# Altium project Kit SECCIM.PrjPcb
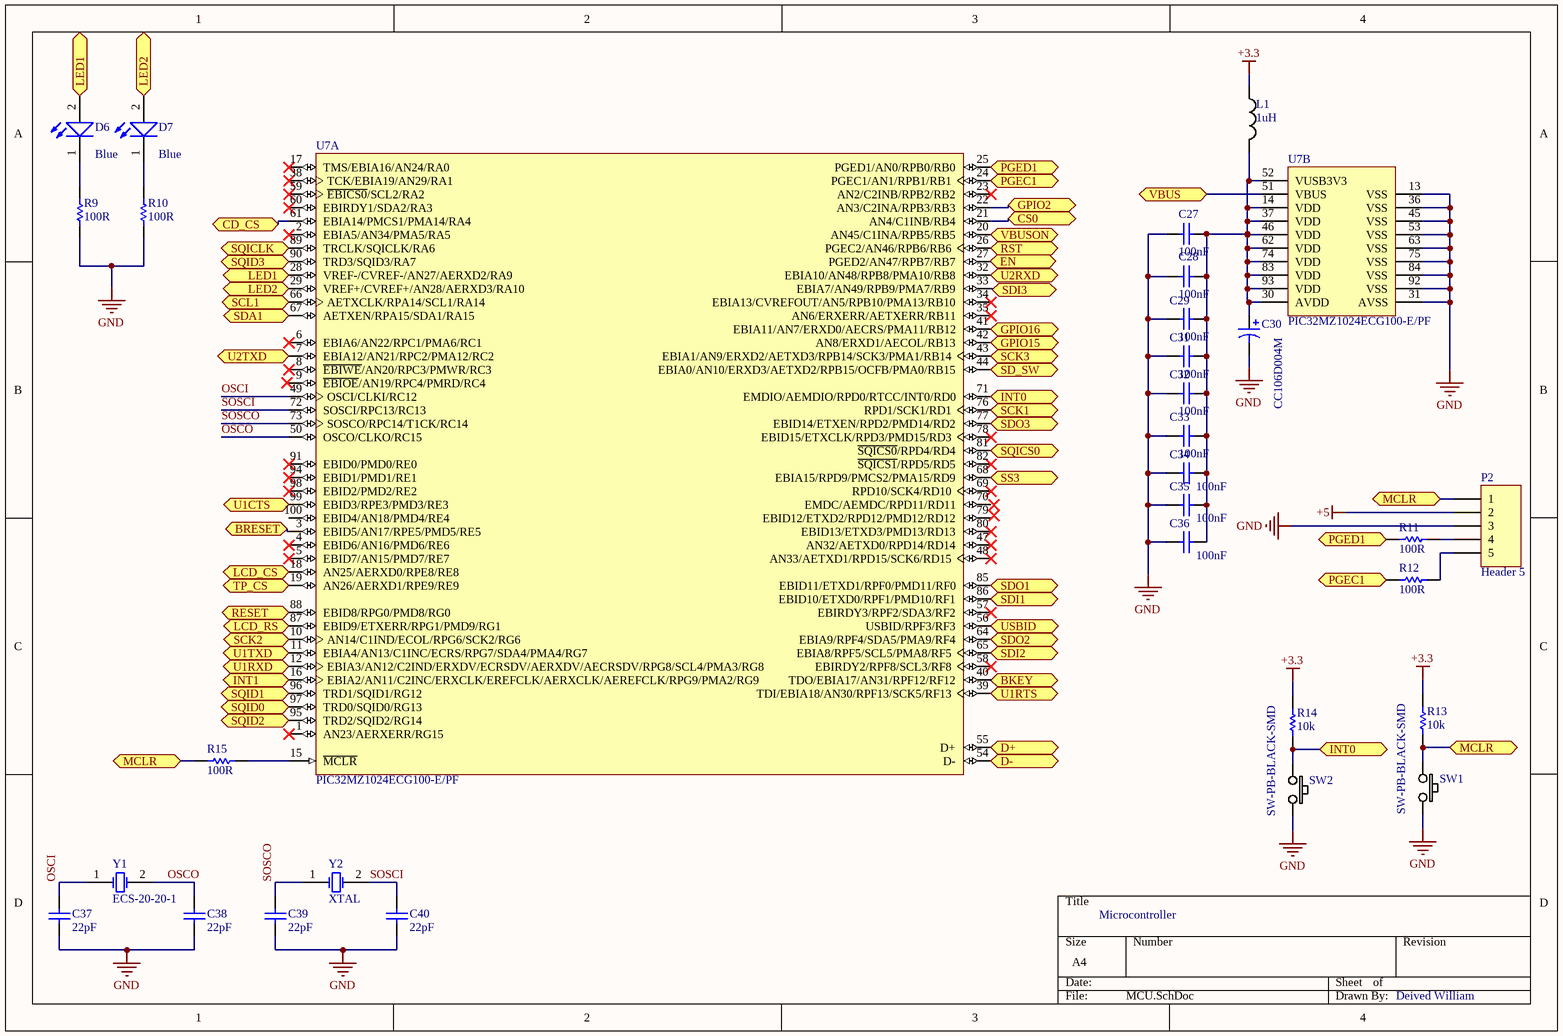
[diagram p0: MCU.SchDoc]
7 sheets, 95 parts. Net scope: flat (ports and power ports of the same name join across sheets).
Board file: PCB.PcbDoc
Sheets:
  MCU.SchDoc
  Memory Nor Flash.SchDoc
  Communication.SchDoc
  LCD.SchDoc
  SD CARD.SchDoc
  CODEC.SchDoc
  Decoupling Capacitors.SchDoc

## Sheet MCU.SchDoc
size A4

### Parts
C27  value 100nF  [WCAP-CSGP_0603, 1.6x0.8x0.8mm_Reflow]  (hidden comment: 885012206020)
C28  value 100nF  [WCAP-CSGP_0603, 1.6x0.8x0.8mm_Reflow]  (hidden comment: 885012206020)
C29  value 100nF  [WCAP-CSGP_0603, 1.6x0.8x0.8mm_Reflow]  (hidden comment: 885012206020)
C30  CC106D004M  [D]
C31  value 100nF  [WCAP-CSGP_0603, 1.6x0.8x0.8mm_Reflow]  (hidden comment: 885012206020)
C32  value 100nF  [WCAP-CSGP_0603, 1.6x0.8x0.8mm_Reflow]  (hidden comment: 885012206020)
C33  value 100nF  [WCAP-CSGP_0603, 1.6x0.8x0.8mm_Reflow]  (hidden comment: 885012206020)
C34  value 100nF  [WCAP-CSGP_0603, 1.6x0.8x0.8mm_Reflow]  (hidden comment: 885012206020)
C35  value 100nF  [WCAP-CSGP_0603, 1.6x0.8x0.8mm_Reflow]  (hidden comment: 885012206020)
C36  value 100nF  [WCAP-CSGP_0603, 1.6x0.8x0.8mm_Reflow]  (hidden comment: 885012206020)
C37  value 22pF  [WCAP-CSGP_0603, 1.6x0.8x0.8mm_Reflow]  (hidden comment: 885012006004)
C38  value 22pF  [WCAP-CSGP_0603, 1.6x0.8x0.8mm_Reflow]  (hidden comment: 885012006004)
C39  value 22pF  [WCAP-CSGP_0603, 1.6x0.8x0.8mm_Reflow]  (hidden comment: 885012006004)
C40  value 22pF  [WCAP-CSGP_0603, 1.6x0.8x0.8mm_Reflow]  (hidden comment: 885012006004)
D6  Emitting Color: Blue  [WL-SMCW_0805]  (hidden comment: 150080BS75000)
D7  Emitting Color: Blue  [WL-SMCW_0805]  (hidden comment: 150080BS75000)
L1  1uH  [TAIYO-NLS5012-GENERIC]
P2  Header 5  [HDR1X5]
R9  100R  [3-0603]
R10  100R  [3-0603]
R11  100R  [3-0603]
R12  100R  [3-0603]
R13  10k  [3-0603]
R14  10k  [3-0603]
R15  100R  [3-0603]
SW1  SW-PB-BLACK-SMD  [SW-PB-SMD]
SW2  SW-PB-BLACK-SMD  [SW-PB-SMD]
U7  PIC32MZ1024ECG100-E/PF  [MCHP-TQFP-PF100_N]  (parts A,B of 2)
Y1  ECS-20-20-1  [HC-49U]
Y2  XTAL  [R38]

### Ports
BKEY, BRESET, CD_CS, CS0, D+, D-, EN, GPIO2, GPIO15, GPIO16, INT0, INT1, LCD_CS, LCD_RS, LED1, LED2, MCLR, PGEC1, PGED1, RESET, RST, SCK1, SCK2, SCK3, SCL1, SD_SW, SDA1, SDI1, SDI2, SDI3, SDO1, SDO2, SDO3, SQICLK, SQICS0, SQID0, SQID1, SQID2, SQID3, SS3, TP_CS, U1CTS, U1RTS, U1RXD, U1TXD, U2RXD, U2TXD, USBID, VBUS, VBUSON

### Nets
+3.3: L1.1 R13.2 R14.2
+5: P2.2
GND: C27.2 C28.2 C29.2 C30.2 C31.2 C32.2 C33.2 C34.2 C35.2 C36.2 C37.1 C38.1 C39.1 C40.1 P2.3 R9.1 R10.1 SW1.2 SW2.2 U7.13(VSS) U7.31(AVSS) U7.36(VSS) U7.45(VSS) U7.53(VSS) U7.63(VSS) U7.75(VSS) U7.84(VSS) U7.92(VSS)
D_N: U7.54(D-) ; port D-
D_P: U7.55(D+) ; port D+
OSCI: C37.2 U7.49(OSCI/CLKI/RC12) Y1.1(OSC1)
OSCO: C38.2 U7.50(OSCO/CLKO/RC15) Y1.2(OSC2)
SOSCI: C40.2 U7.72(SOSCI/RPC13/RC13) Y2.2(OSC2)
SOSCO: C39.2 U7.73(SOSCO/RPC14/T1CK/RC14) Y2.1(OSC1)
NetC18_2: U7.51(VBUS) ; port VBUS
NetC27_1: C27.1 C28.1 C29.1 C30.1 C31.1 C32.1 C33.1 C34.1 C35.1 C36.1 L1.2 U7.14(VDD) U7.30(AVDD) U7.37(VDD) U7.46(VDD) U7.52(VUSB3V3) U7.62(VDD) U7.74(VDD) U7.83(VDD) U7.93(VDD)
NetD6_1: D6.1(K) R9.2
NetD6_2: D6.2(A) U7.28(VREF-/CVREF-/AN27/AERXD2/RA9) ; port LED1
NetD7_1: D7.1(K) R10.2
NetD7_2: D7.2(A) U7.29(VREF+/CVREF+/AN28/AERXD3/RA10) ; port LED2
NetJ2_4: U7.56(USBID/RPF3/RF3) ; port USBID
NetJ4_2: U7.61(EBIA14/PMCS1/PMA14/RA4) ; port CD_CS
NetJ4_3: U7.64(EBIA9/RPF4/SDA5/PMA9/RF4) ; port SDO2
NetJ4_5: U7.10(AN14/C1IND/ECOL/RPG6/SCK2/RG6) ; port SCK2
NetJ4_7: U7.65(EBIA8/RPF5/SCL5/PMA8/RF5) ; port SDI2
NetJ4_11: U7.44(EBIA0/AN10/ERXD3/AETXD2/RPB15/OCFB/PMA0/RB15) ; port SD_SW
NetP1_11: U7.16(EBIA2/AN11/C2INC/ERXCLK/EREFCLK/AERXCLK/AEREFCLK/RPG9/PMA2/RG9) ; port INT1
NetP1_13: U7.88(EBID8/RPG0/PMD8/RG0) ; port RESET
NetP1_15: U7.87(EBID9/ETXERR/RPG1/PMD9/RG1) ; port LCD_RS
NetP1_19: U7.85(EBID11/ETXD1/RPF0/PMD11/RF0) ; port SDO1
NetP1_21: U7.86(EBID10/ETXD0/RPF1/PMD10/RF1) ; port SDI1
NetP1_23: U7.76(RPD1/SCK1/RD1) ; port SCK1
NetP1_24: U7.18(AN25/AERXD0/RPE8/RE8) ; port LCD_CS
NetP1_26: U7.19(AN26/AERXD1/RPE9/RE9) ; port TP_CS
NetP2_1: P2.1 R13.1 R15.1 SW1.1 ; port MCLR
NetP2_4: P2.4 R11.2
NetP2_5: P2.5 R12.2
NetR3_1: U7.66(AETXCLK/RPA14/SCL1/RA14) ; port SCL1
NetR4_1: U7.67(AETXEN/RPA15/SDA1/RA15) ; port SDA1
NetR11_1: R11.1 U7.25(PGED1/AN0/RPB0/RB0) ; port PGED1
NetR12_1: R12.1 U7.24(PGEC1/AN1/RPB1/RB1) ; port PGEC1
NetR14_1: R14.1 SW2.1 U7.71(EMDIO/AEMDIO/RPD0/RTCC/INT0/RD0) ; port INT0
NetR15_2: R15.2 U7.15(~{MCLR})
NetR16_1: U7.89(TRCLK/SQICLK/RA6) ; port SQICLK
NetR17_2: U7.81(~{SQICS0}/RPD4/RD4) ; port SQICS0
NetR18_1: U7.97(TRD0/SQID0/RG13) ; port SQID0
NetR19_2: U7.95(TRD2/SQID2/RG14) ; port SQID2
NetR20_1: U7.96(TRD1/SQID1/RG12) ; port SQID1
NetR21_2: U7.90(TRD3/SQID3/RA7) ; port SQID3
NetU1_5: U7.43(EBIA1/AN9/ERXD2/AETXD3/RPB14/SCK3/PMA1/RB14) ; port SCK3
NetU1_6: U7.77(EBID14/ETXEN/RPD2/PMD14/RD2) ; port SDO3
NetU1_7: U7.68(EBIA15/RPD9/PMCS2/PMA15/RD9) ; port SS3
NetU1_8: U7.33(EBIA7/AN49/RPB9/PMA7/RB9) ; port SDI3
NetU2_1: U7.12(EBIA3/AN12/C2IND/ERXDV/ECRSDV/AERXDV/AECRSDV/RPG8/SCL4/PMA3/RG8) ; port U1RXD
NetU2_2: U7.11(EBIA4/AN13/C1INC/ECRS/RPG7/SDA4/PMA4/RG7) ; port U1TXD
NetU2_3: U7.39(TDI/EBIA18/AN30/RPF13/SCK5/RF13) ; port U1RTS
NetU2_4: U7.99(EBID3/RPE3/PMD3/RE3) ; port U1CTS
NetU2_11: U7.3(EBID5/AN17/RPE5/PMD5/RE5) ; port BRESET
NetU2_34: U7.40(TDO/EBIA17/AN31/RPF12/RF12) ; port BKEY
NetU3_7: U7.20(AN45/C1INA/RPB5/RB5) ; port VBUSON
NetU4_1: U7.26(PGEC2/AN46/RPB6/RB6) ; port RST
NetU4_3: U7.27(PGED2/AN47/RPB7/RB7) ; port EN
NetU4_4: U7.41(EBIA11/AN7/ERXD0/AECRS/PMA11/RB12) ; port GPIO16
NetU4_16: U7.42(AN8/ERXD1/AECOL/RB13) ; port GPIO15
NetU4_17: U7.22(AN3/C2INA/RPB3/RB3) ; port GPIO2
NetU4_18: U7.21(AN4/C1INB/RB4) ; port CS0
NetU4_21: U7.7(EBIA12/AN21/RPC2/PMA12/RC2) ; port U2TXD
NetU4_22: U7.32(EBIA10/AN48/RPB8/PMA10/RB8) ; port U2RXD

Not connected (* = marked no-connect by the designer): U7 1(AN23/AERXERR/RG15)* 2(EBIA5/AN34/PMA5/RA5)* 4(EBID6/AN16/PMD6/RE6)* 5(EBID7/AN15/PMD7/RE7)* 6(EBIA6/AN22/RPC1/PMA6/RC1)* 8(~{EBIWE}/AN20/RPC3/PMWR/RC3)* 9(~{EBIOE}/AN19/RPC4/PMRD/RC4) 17(TMS/EBIA16/AN24/RA0)* 23(AN2/C2INB/RPB2/RB2)* 34(EBIA13/CVREFOUT/AN5/RPB10/PMA13/RB10)* 35(AN6/ERXERR/AETXERR/RB11)* 38(TCK/EBIA19/AN29/RA1)* 47(AN32/AETXD0/RPD14/RD14)* 48(AN33/AETXD1/RPD15/SCK6/RD15)* 57(EBIRDY3/RPF2/SDA3/RF2)* 58(EBIRDY2/RPF8/SCL3/RF8)* 59(~{EBICS0}/SCL2/RA2)* 60(EBIRDY1/SDA2/RA3)* 69(RPD10/SCK4/RD10)* 70(EMDC/AEMDC/RPD11/RD11) 78(EBID15/ETXCLK/RPD3/PMD15/RD3)* 79(EBID12/ETXD2/RPD12/PMD12/RD12) 80(EBID13/ETXD3/PMD13/RD13)* 82(~{SQICS1}/RPD5/RD5)* 91(EBID0/PMD0/RE0)* 94(EBID1/PMD1/RE1)* 98(EBID2/PMD2/RE2)* 100(EBID4/AN18/PMD4/RE4)

### Notes on the sheet
- Microcontroller
- Deived William

### Library data of the parts
C27-C29 C31-C36 = 885012206020: WCAP-CSGP Ceramic Capacitors, size 0603, 1.6x0.8x0.8mm, 10V, X7R, 100nF; Rated Voltage: 10V DC; ComponentLink1Description: Manufacturer; ComponentLink1URL: http://www.we-online.de; ComponentLink2Description: Datasheet; ComponentLink2URL: http://katalog.we-online.de/pbs/datasheet/885012206020.pdf; Part Number: 885012206020; Published Date: June 2017; Publisher: Wurth Elektronik; Size: 0603, 1.6x0.8x0.8mm; Ceramic Type: X7R
C30 = CC106D004M: Conformal Coated Solid Tantalum Chip Capacitor: Standard Range, 10uF, 20% Tolerance, 4 WVDC @ -55°C to +85°C, Surge = 5V; Note: See Data Sheet for full range of components; Published: 19-Mar-2004; DatasheetDocument: 21-Mar-2002; PackageReference: D; Publisher: Altium Limited; ComponentLink1Description: Manufacturer Link; ComponentLink1URL: http://www.vishay.com/; ComponentLink2Description: Datasheet; ComponentLink2URL: http://www.vishay.com/docs/43017/ccec.pdf; Value: 10uF
C37-C40 = 885012006004: WCAP-CSGP Ceramic Capacitors, size 0603, 1.6x0.8x0.8mm, 10V, NP0, 22pF; Rated Voltage: 10V DC; ComponentLink1Description: Manufacturer; ComponentLink1URL: http://www.we-online.de; ComponentLink2Description: Datasheet; ComponentLink2URL: http://katalog.we-online.de/pbs/datasheet/885012006004.pdf; Part Number: 885012006004; Published Date: June 2017; Publisher: Wurth Elektronik; Size: 0603, 1.6x0.8x0.8mm; Ceramic Type: NP0
D6 D7 = 150080BS75000: WL-SMCW SMD Mono-color Chip LED Waterclear, size 0805, Blue; Forward Voltage: 3.2 V; Viewing Angle: 140°; Peak Wavelength: 465 nm; Published Date: Jan 2017; Publisher: Wurth Elektronik; ComponentLink1Description: Manufacturer; ComponentLink1URL: http://www.we-online.de; ComponentLink2Description: Datasheet; ComponentLink2URL: http://katalog.we-online.de/led/datasheet/150080BS75000.pdf; Part Number: 150080BS75000; Size: 0805
L1 = 1U-NRS5012-TAIYO: 1U-NRS5012
P2 = Header 5: Header, 5-Pin; LatestRevisionDate: 17-Jul-2002; LatestRevisionNote: Re-released for DXP Platform.; Publisher: Altium Limited
R9-R15 = ERJ3RE: Precision Thick Film Chip Resistor, 10 Ohm to 1M Ohm Range, 1% and 0.5% Tolerance, 0603 Size, 0.063 W; Published: 17-Dec-2003; LatestRevisionDate: 19-Mar-2004; LatestRevisionNote: Silkscreen size reduced.; PackageDocument: Mar-2003; PackageReference: 3-0603; Publisher: Altium Limited; Code_IPC: 1608 [0603]; ComponentLink1Description: Manufacturer Link; ComponentLink1URL: http://www.panasonic.com/industrial/components/resistive_products.htm; ComponentLink2Description: Datasheet; ComponentLink2URL: http://www.panasonic.com/industrial/components/pdf/AOA0000CE2.pdf
SW1 SW2 = SW-PB-BLACK-SMD: PUSHBUTTON SWITCH 6MM SMD
U7 = PIC32MZ1024ECG100-E/PF: 32-Bit Microcontroller with Audio and Graphics Interfaces, HS USB, Ethernet, and Advanced Analog, 1024 KB Program Memory, 78 I/O Pins, PMP, Extended Temperature, 100-Pin TQFP (PF100), Tray; Manufacturer: Microchip; VCC Range: 2.2 to 3.6 V; DatasheetVersion: Rev. B; PackageVersion: C04-110B, 12/2012; PackageReference: TQFP-PF100; PackageDescription: 100-Lead Thin Plastic Quad Flat Pack, 14 x 14 mm Body, 0.5 mm Pitch; Supplier 1: Newark; Supplier Part Number 1: 17X9269; Supplier 2: Mouser; Supplier Part Number 2: 579-1024ECG100-E/PF; Packing: Tray; Mounting Technology: Surface Mount; PartNumber: PIC32MZ1024ECG100-E/PF; ComponentLink1Description: Manufacturer URL; ComponentLink1URL: http://www.microchip.com/; ComponentLink2Description: Datasheet; ComponentLink2URL: http://ww1.microchip.com/downloads/en/DeviceDoc/60001191B.pdf; ComponentLink3Description: Package Specification; ComponentLink3URL: http://www.microchip.com/stellent/groups/techpub_sg/documents/packagingspec/en012702.pdf
Y1 = ECS-20-20-1: Crystal Oscillator; Published: 17-Jul-2002; DatasheetDocument: 18-Apr-2000; PackageReference: HC-49U; Publisher: Altium Limited; ComponentLink1Description: Manufacturer Link; ComponentLink1URL: http://www.ecsxtal.com/; ComponentLink2Description: Datasheet; ComponentLink2URL: http://www.ecsxtal.com/pdf2/HC49U.PDF
Y2 = XTAL: Crystal Oscillator; Published: 8-Jun-2000; LatestRevisionDate: 17-Jul-2002; LatestRevisionNote: Re-released for DXP Platform.; PackageReference: R38; Publisher: Altium Limited; PackageDescription: Crystal, Thru-Hole; 2 Leads; Body 3.1 x 8.2 mm (Dia.xH)

## Sheet Memory Nor Flash.SchDoc
size A4
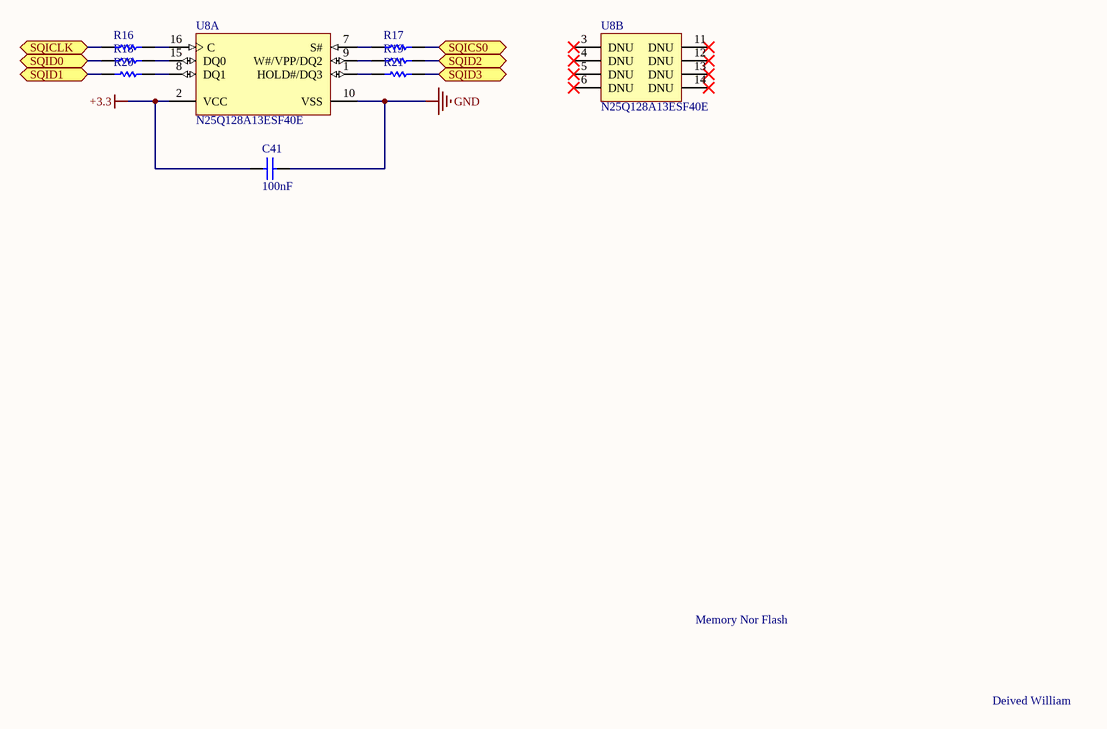
[diagram p1: Memory Nor Flash.SchDoc]

### Parts
C41  value 100nF  [WCAP-CSGP_0603, 1.6x0.8x0.8mm_Reflow]  (hidden comment: 885012206020)
R16  50R  [3-0603]  (value not drawn)
R17  50R  [3-0603]  (value not drawn)
R18  50R  [3-0603]  (value not drawn)
R19  50R  [3-0603]  (value not drawn)
R20  50R  [3-0603]  (value not drawn)
R21  50R  [3-0603]  (value not drawn)
U8  N25Q128A13ESF40E  [MICT-SF-16_N]  (parts A,B of 2)

### Ports
SQICLK, SQICS0, SQID0, SQID1, SQID2, SQID3

### Nets
+3.3: C41.1 U8.2(VCC)
GND: C41.2 U8.10(VSS)
NetR16_1: R16.1 ; port SQICLK
NetR16_2: R16.2 U8.16(C)
NetR17_1: R17.1 U8.7(S#)
NetR17_2: R17.2 ; port SQICS0
NetR18_1: R18.1 ; port SQID0
NetR18_2: R18.2 U8.15(DQ0)
NetR19_1: R19.1 U8.9(W#/VPP/DQ2)
NetR19_2: R19.2 ; port SQID2
NetR20_1: R20.1 ; port SQID1
NetR20_2: R20.2 U8.8(DQ1)
NetR21_1: R21.1 U8.1(HOLD#/DQ3)
NetR21_2: R21.2 ; port SQID3

Not connected (* = marked no-connect by the designer): U8 3(DNU)* 4(DNU)* 5(DNU)* 6(DNU)* 11(DNU)* 12(DNU)* 13(DNU)* 14(DNU)*

### Notes on the sheet
- Memory Nor Flash
- Deived William

### Library data of the parts
C41 = 885012206020: as C27 on sheet MCU; ComponentLink1Description: Manufacturer; ComponentLink1URL: http://www.we-online.de; ComponentLink2Description: Datasheet; ComponentLink2URL: http://katalog.we-online.de/pbs/datasheet/885012206020.pdf; Part Number: 885012206020; Published Date: June 2017; Publisher: Wurth Elektronik; Size: 0603, 1.6x0.8x0.8mm; Ceramic Type: X7R
R16-R21 = ERJ3RE: as R9 on sheet MCU; Published: 17-Dec-2003; LatestRevisionDate: 19-Mar-2004; LatestRevisionNote: Silkscreen size reduced.; PackageDocument: Mar-2003; PackageReference: 3-0603; Publisher: Altium Limited; Code_IPC: 1608 [0603]; ComponentLink1Description: Manufacturer Link; ComponentLink1URL: http://www.panasonic.com/industrial/components/resistive_products.htm; ComponentLink2Description: Datasheet; ComponentLink2URL: http://www.panasonic.com/industrial/components/pdf/AOA0000CE2.pdf
U8 = N25Q128A13ESF40E: 128 Mb (x1/x2/x4) Serial NOR Flash Memory with Multi I/O, 108 MHz, 2.7 to 3.6 V, 16-pin SO16 Wide (SF), Tray; Part Family: N25Q; Manufacturer: Micron; Density: 128Mb; Speed: 108 MHz; Voltage: 2.7V-3.6V; DatasheetVersion: Rev. L; PackageVersion: Rev. F; PackageReference: MICT-SF-16; PackageDescription: 16-Pin SO Wide, 7.5 X 10.3 mm, Pitch 1.27 mm; Applications: Embedded; Package: SO16 Wide; Part Status: Production; RoHS: Yes; Type: Multi I/O; Width: x1/x2/x4; Mounting Technology: Surface Mount; PartNumber: N25Q128A13ESF40E; ComponentLink1Description: Manufacturer URL; ComponentLink1URL: http://www.micron.com/; ComponentLink2Description: Datasheet; ComponentLink2URL: http://www.micron.com/~/media/Documents/Products/Data%20Sheet/NOR%20Flash/Serial%20NOR/N25Q/n25q_128mb_3v_65nm.pdf; ComponentLink3Description: Package Specification; ComponentLink3URL: http://www.micron.com/~/media/Documents/Products/Data%20Sheet/NOR%20Flash/Serial%20NOR/N25Q/n25q_1gb_3v_65nm.pdf

## Sheet Communication.SchDoc
size A4
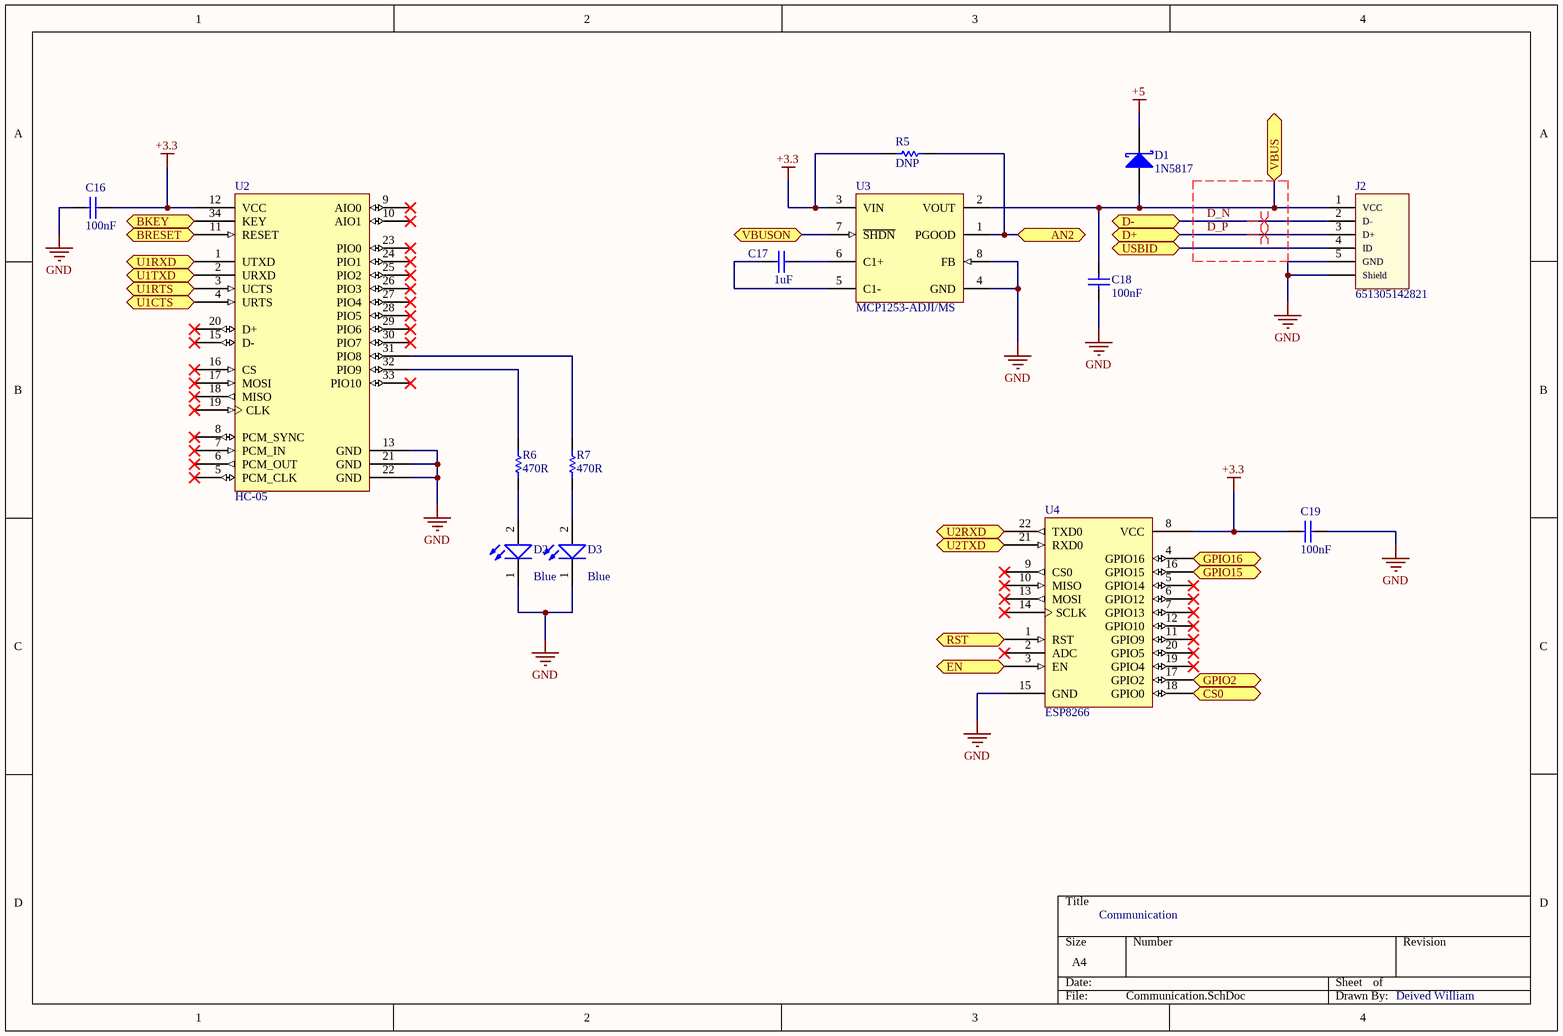
[diagram p2: Communication.SchDoc]

### Parts
C16  value 100nF  [WCAP-CSGP_0603, 1.6x0.8x0.8mm_Reflow]  (hidden comment: 885012206020)
C17  value 1uF  [WCAP-CSGP_0603, 1.6x0.8x0.8mm_Reflow]  (hidden comment: 885012106022)
C18  value 100nF  [WCAP-CSGP_0603, 1.6x0.8x0.8mm_Reflow]  (hidden comment: 885012206020)
C19  value 100nF  [WCAP-CSGP_0603, 1.6x0.8x0.8mm_Reflow]  (hidden comment: 885012206020)
D1  1N5817  [MELFDIODE]
D2  Emitting Color: Blue  [WL-SMCW_0805]  (hidden comment: 150080BS75000)
D3  Emitting Color: Blue  [WL-SMCW_0805]  (hidden comment: 150080BS75000)
J2  651305142821  [651305142821]
R5  DNP  [3-0603]
R6  470R  [3-0603]
R7  470R  [3-0603]
U2  HC-05  [LCC42]
U3  MCP1253-ADJI/MS  [MSOP-MS8_N]
U4  ESP8266  [LCC28]

### Ports
AN2, BKEY, BRESET, CS0, D+, D-, EN, GPIO2, GPIO15, GPIO16, RST, U1CTS, U1RTS, U1RXD, U1TXD, U2RXD, U2TXD, USBID, VBUS, VBUSON

### Nets
+3.3: C16.2 C19.1 R5.1 U2.12(VCC) U3.3(VIN) U4.8(VCC)
+5: D1.2(K)
GND: C16.1 C18.1 C19.2 D2.1(K) D3.1(K) J2.5(GND) J2.Shell(Shield) U2.13(GND) U2.21(GND) U2.22(GND) U3.4(GND) U3.8(FB) U4.15(GND)
D_N: J2.2(D-) ; port D-
D_P: J2.3(D+) ; port D+
NetC17_1: C17.1 U3.6(C1+)
NetC17_2: C17.2 U3.5(C1-)
NetC18_2: C18.2 D1.1(A) J2.1(VCC) U3.2(VOUT) ; port VBUS
NetD2_2: D2.2(A) R6.1
NetD3_2: D3.2(A) R7.1
NetJ2_4: J2.4(ID) ; port USBID
NetR5_2: R5.2 U3.1(PGOOD) ; port AN2
NetR6_2: R6.2 U2.32(PIO9)
NetR7_2: R7.2 U2.31(PIO8)
NetU2_1: U2.1(UTXD) ; port U1RXD
NetU2_2: U2.2(URXD) ; port U1TXD
NetU2_3: U2.3(UCTS) ; port U1RTS
NetU2_4: U2.4(URTS) ; port U1CTS
NetU2_11: U2.11(RESET) ; port BRESET
NetU2_34: U2.34(KEY) ; port BKEY
NetU3_7: U3.7(~{SHDN}) ; port VBUSON
NetU4_1: U4.1(RST) ; port RST
NetU4_3: U4.3(EN) ; port EN
NetU4_4: U4.4(GPIO16) ; port GPIO16
NetU4_16: U4.16(GPIO15) ; port GPIO15
NetU4_17: U4.17(GPIO2) ; port GPIO2
NetU4_18: U4.18(GPIO0) ; port CS0
NetU4_21: U4.21(RXD0) ; port U2TXD
NetU4_22: U4.22(TXD0) ; port U2RXD

Not connected (* = marked no-connect by the designer): U2 5(PCM_CLK)* 6(PCM_OUT)* 7(PCM_IN)* 8(PCM_SYNC)* 9(AIO0)* 10(AIO1)* 15(D-)* 16(CS)* 17(MOSI)* 18(MISO)* 19(CLK)* 20(D+)* 23(PIO0)* 24(PIO1)* 25(PIO2)* 26(PIO3)* 27(PIO4)* 28(PIO5)* 29(PIO6)* 30(PIO7)* 33(PIO10)*; U4 2(ADC)* 5(GPIO14)* 6(GPIO12)* 7(GPIO13)* 9(CS0)* 10(MISO)* 11(GPIO9)* 12(GPIO10)* 13(MOSI)* 14(SCLK)* 19(GPIO4)* 20(GPIO5)*

### Layout directives
differential pair: D_N, D_P

### Notes on the sheet
- Communication
- Deived William

### Library data of the parts
C16 C18 C19 = 885012206020: as C27 on sheet MCU; ComponentLink1Description: Manufacturer; ComponentLink1URL: http://www.we-online.de; ComponentLink2Description: Datasheet; ComponentLink2URL: http://katalog.we-online.de/pbs/datasheet/885012206020.pdf; Part Number: 885012206020; Published Date: June 2017; Publisher: Wurth Elektronik; Size: 0603, 1.6x0.8x0.8mm; Ceramic Type: X7R
C17 = 885012106022: WCAP-CSGP Ceramic Capacitors, size 0603, 1.6x0.8x0.8mm, 25V, X5R, 1uF; Rated Voltage: 25V DC; ComponentLink1Description: Manufacturer; ComponentLink1URL: http://www.we-online.de; ComponentLink2Description: Datasheet; ComponentLink2URL: http://katalog.we-online.de/pbs/datasheet/885012106022.pdf; Part Number: 885012106022; Published Date: June 2017; Publisher: Wurth Elektronik; Size: 0603, 1.6x0.8x0.8mm; Ceramic Type: X5R
D1 = 1N5817: Schottky diode Barrier Rectifier
D2 D3 = 150080BS75000: as D6 on sheet MCU; Published Date: Jan 2017; Publisher: Wurth Elektronik; ComponentLink1Description: Manufacturer; ComponentLink1URL: http://www.we-online.de; ComponentLink2Description: Datasheet; ComponentLink2URL: http://katalog.we-online.de/led/datasheet/150080BS75000.pdf; Part Number: 150080BS75000; Size: 0805
J2 = 651305142821: Mini USB 2.0 Type AB SMT Horizontal 5 Contacts WR-COM; Interface Type: Type AB; Gender: Receptacle; ComponentLink1Description: Manufacturer; ComponentLink1URL: http://www.we-online.de; ComponentLink2Description: Datasheet; ComponentLink2URL: http://katalog.we-online.de/em/datasheet/651305142821.pdf; Part Number: 651305142821; Published Date: April 2017; Publisher: Wurth Elektronik; Sub-Family: Mini USB 2.0; Type: Horizontal; Construction: SMT
R5 = ERJ3RB: Precision Thick Film Chip Resistor, 10 Ohm to 1M Ohm Range, 1% and 0.5% Tolerance, 0603 Size, 0.063 W; Published: 17-Dec-2003; LatestRevisionDate: 19-Mar-2004; LatestRevisionNote: Silkscreen size reduced.; PackageDocument: Mar-2003; PackageReference: 3-0603; Publisher: Altium Limited; Code_IPC: 1608 [0603]; ComponentLink1Description: Manufacturer Link; ComponentLink1URL: http://www.panasonic.com/industrial/components/resistive_products.htm; ComponentLink2Description: Datasheet; ComponentLink2URL: http://www.panasonic.com/industrial/components/pdf/AOA0000CE2.pdf
R6 R7 = ERJ3RE: as R9 on sheet MCU; Published: 17-Dec-2003; LatestRevisionDate: 19-Mar-2004; LatestRevisionNote: Silkscreen size reduced.; PackageDocument: Mar-2003; PackageReference: 3-0603; Publisher: Altium Limited; Code_IPC: 1608 [0603]; ComponentLink1Description: Manufacturer Link; ComponentLink1URL: http://www.panasonic.com/industrial/components/resistive_products.htm; ComponentLink2Description: Datasheet; ComponentLink2URL: http://www.panasonic.com/industrial/components/pdf/AOA0000CE2.pdf
U2 = Bluetooth HC-05: Modulo Bluetooth HC-05
U3 = MCP1253-ADJI/MS: Low Noise, Positive-Regulated Charge Pump, 1MHz, Adjustable Output, 8-Pin MSOP, Industrial Temperature; Published: 29-Jan-2009; DatasheetVersion: revA, Nov-2002; PackageVersion: revBB, Aug-2009; PackageReference: MSOP-MS8; Publisher: Altium Limited; PackageDescription: 8-Lead Plastic Micro Small Outline Package (MS) [MSOP]; Supplier 1: Digi-Key; Supplier Part Number 1: MCP1253-ADJI/MS-ND; Supplier 2: Farnell; Supplier Part Number 2: 1332068; ComponentLink1Description: Datasheet; ComponentLink1URL: http://ww1.microchip.com/downloads/en/DeviceDoc/21752a.pdf; ComponentLink2Description: Packaging Specification; ComponentLink2URL: http://www.microchip.com/stellent/groups/techpub_sg/documents/packagingspec/en012702.pdf; ComponentLink3Description: Microchip.com Home; ComponentLink3URL: http://www.microchip.com/
U4 = ESP8266: Modulo WIFI ESP8266

## Sheet LCD.SchDoc
size A4
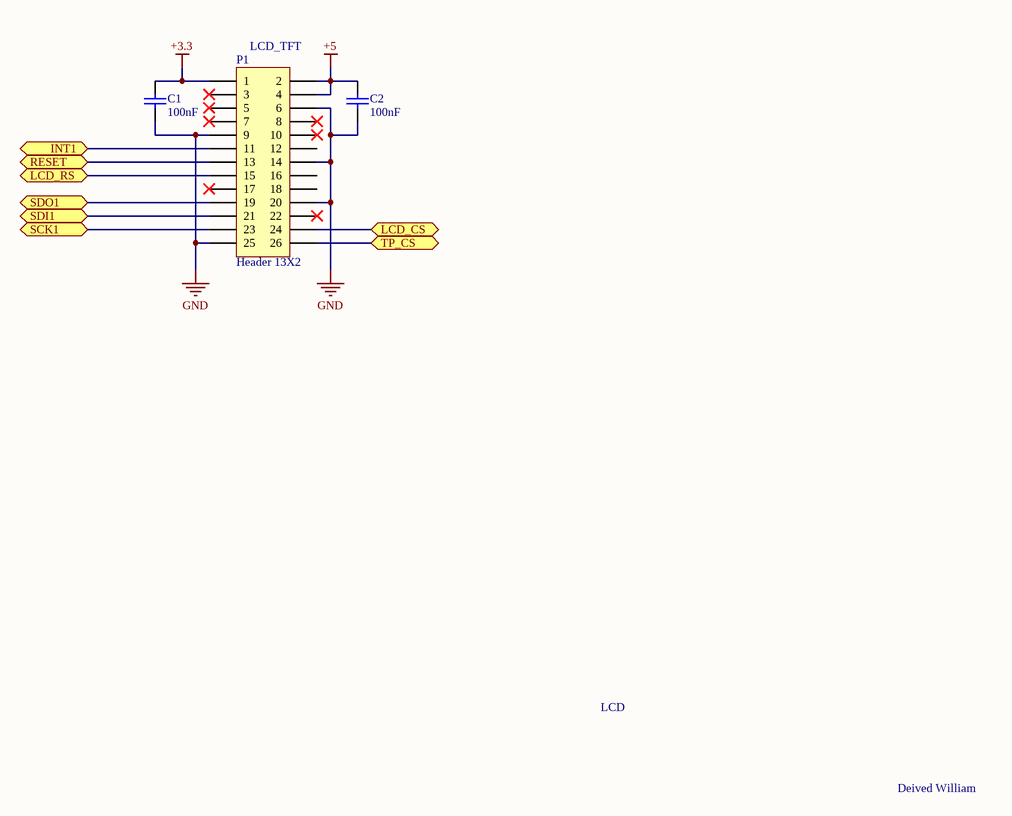
[diagram p3: LCD.SchDoc]

### Parts
C1  value 100nF  [WCAP-CSGP_0603, 1.6x0.8x0.8mm_Reflow]  (hidden comment: 885012206020)
C2  value 100nF  [WCAP-CSGP_0603, 1.6x0.8x0.8mm_Reflow]  (hidden comment: 885012206020)
P1  Header 13X2  [HDR2X13]

### Ports
INT1, LCD_CS, LCD_RS, RESET, SCK1, SDI1, SDO1, TP_CS

### Nets
+3.3: C1.2 P1.1
+5: C2.2 P1.2 P1.4
GND: C1.1 C2.1 P1.6 P1.9 P1.14 P1.20 P1.25
NetP1_11: P1.11 ; port INT1
NetP1_13: P1.13 ; port RESET
NetP1_15: P1.15 ; port LCD_RS
NetP1_19: P1.19 ; port SDO1
NetP1_21: P1.21 ; port SDI1
NetP1_23: P1.23 ; port SCK1
NetP1_24: P1.24 ; port LCD_CS
NetP1_26: P1.26 ; port TP_CS

Not connected (* = marked no-connect by the designer): P1 3* 5* 7* 8* 10* 12 16 17* 18 22*

### Notes on the sheet
- (near P1) LCD_TFT
- LCD
- Deived William

### Library data of the parts
C1 C2 = 885012206020: as C27 on sheet MCU; ComponentLink1Description: Manufacturer; ComponentLink1URL: http://www.we-online.de; ComponentLink2Description: Datasheet; ComponentLink2URL: http://katalog.we-online.de/pbs/datasheet/885012206020.pdf; Part Number: 885012206020; Published Date: June 2017; Publisher: Wurth Elektronik; Size: 0603, 1.6x0.8x0.8mm; Ceramic Type: X7R
P1 = Header 13X2: Header, 13-Pin, Dual row; LatestRevisionDate: 17-Jul-2002; LatestRevisionNote: Re-released for DXP Platform.; Publisher: Altium Limited

## Sheet SD CARD.SchDoc
size A4
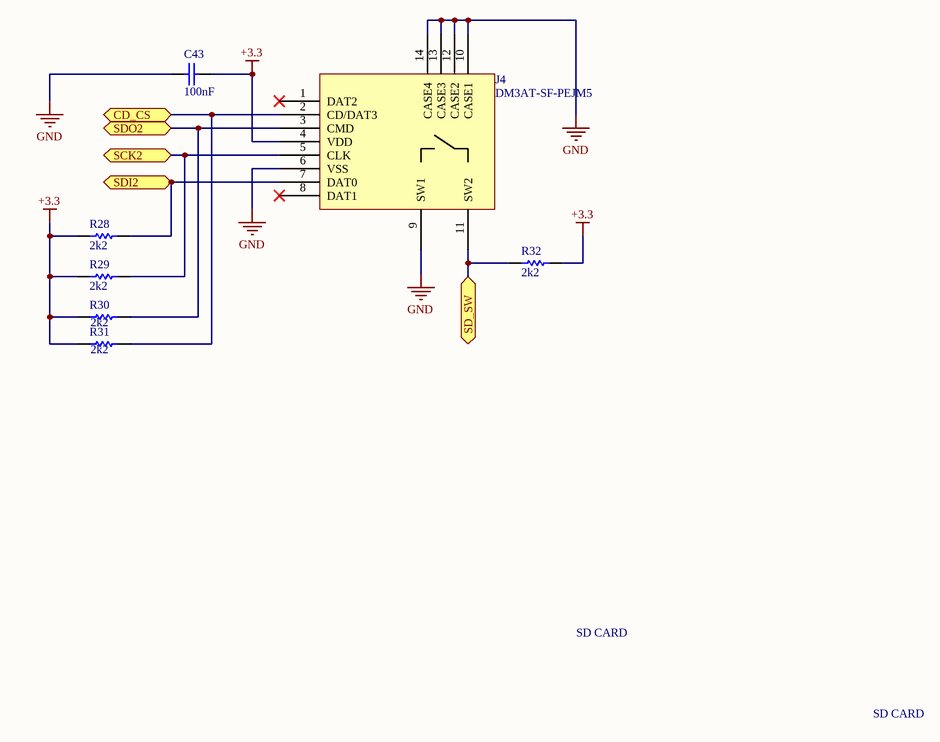
[diagram p4: SD CARD.SchDoc]

### Parts
C43  value 100nF  [WCAP-CSGP_0603, 1.6x0.8x0.8mm_Reflow]  (hidden comment: 885012206020)
J4  DM3AT-SF-PEJM5  [SD CARD MICRO]
R28  2k2  [3-0603]
R29  2k2  [3-0603]
R30  2k2  [3-0603]
R31  2k2  [3-0603]
R32  2k2  [3-0603]

### Ports
CD_CS, SCK2, SD_SW, SDI2, SDO2

### Nets
+3.3: C43.2 J4.4(VDD) R28.1 R29.1 R30.1 R31.1 R32.2
GND: C43.1 J4.6(VSS) J4.9(SW1) J4.10(CASE1) J4.12(CASE2) J4.13(CASE3) J4.14(CASE4)
NetJ4_2: J4.2(CD/DAT3) R31.2 ; port CD_CS
NetJ4_3: J4.3(CMD) R30.2 ; port SDO2
NetJ4_5: J4.5(CLK) R29.2 ; port SCK2
NetJ4_7: J4.7(DAT0) R28.2 ; port SDI2
NetJ4_11: J4.11(SW2) R32.1 ; port SD_SW

Not connected (* = marked no-connect by the designer): J4 1(DAT2)* 8(DAT1)*

### Notes on the sheet
- SD CARD

### Library data of the parts
C43 = 885012206020: as C27 on sheet MCU; ComponentLink1Description: Manufacturer; ComponentLink1URL: http://www.we-online.de; ComponentLink2Description: Datasheet; ComponentLink2URL: http://katalog.we-online.de/pbs/datasheet/885012206020.pdf; Part Number: 885012206020; Published Date: June 2017; Publisher: Wurth Elektronik; Size: 0603, 1.6x0.8x0.8mm; Ceramic Type: X7R
J4 = DM3AT-SF-PEJM5: Conector micro SD push/push
R28-R32 = ERJ3RE: as R9 on sheet MCU; Published: 17-Dec-2003; LatestRevisionDate: 19-Mar-2004; LatestRevisionNote: Silkscreen size reduced.; PackageDocument: Mar-2003; PackageReference: 3-0603; Publisher: Altium Limited; Code_IPC: 1608 [0603]; ComponentLink1Description: Manufacturer Link; ComponentLink1URL: http://www.panasonic.com/industrial/components/resistive_products.htm; ComponentLink2Description: Datasheet; ComponentLink2URL: http://www.panasonic.com/industrial/components/pdf/AOA0000CE2.pdf

## Sheet CODEC.SchDoc
size A4
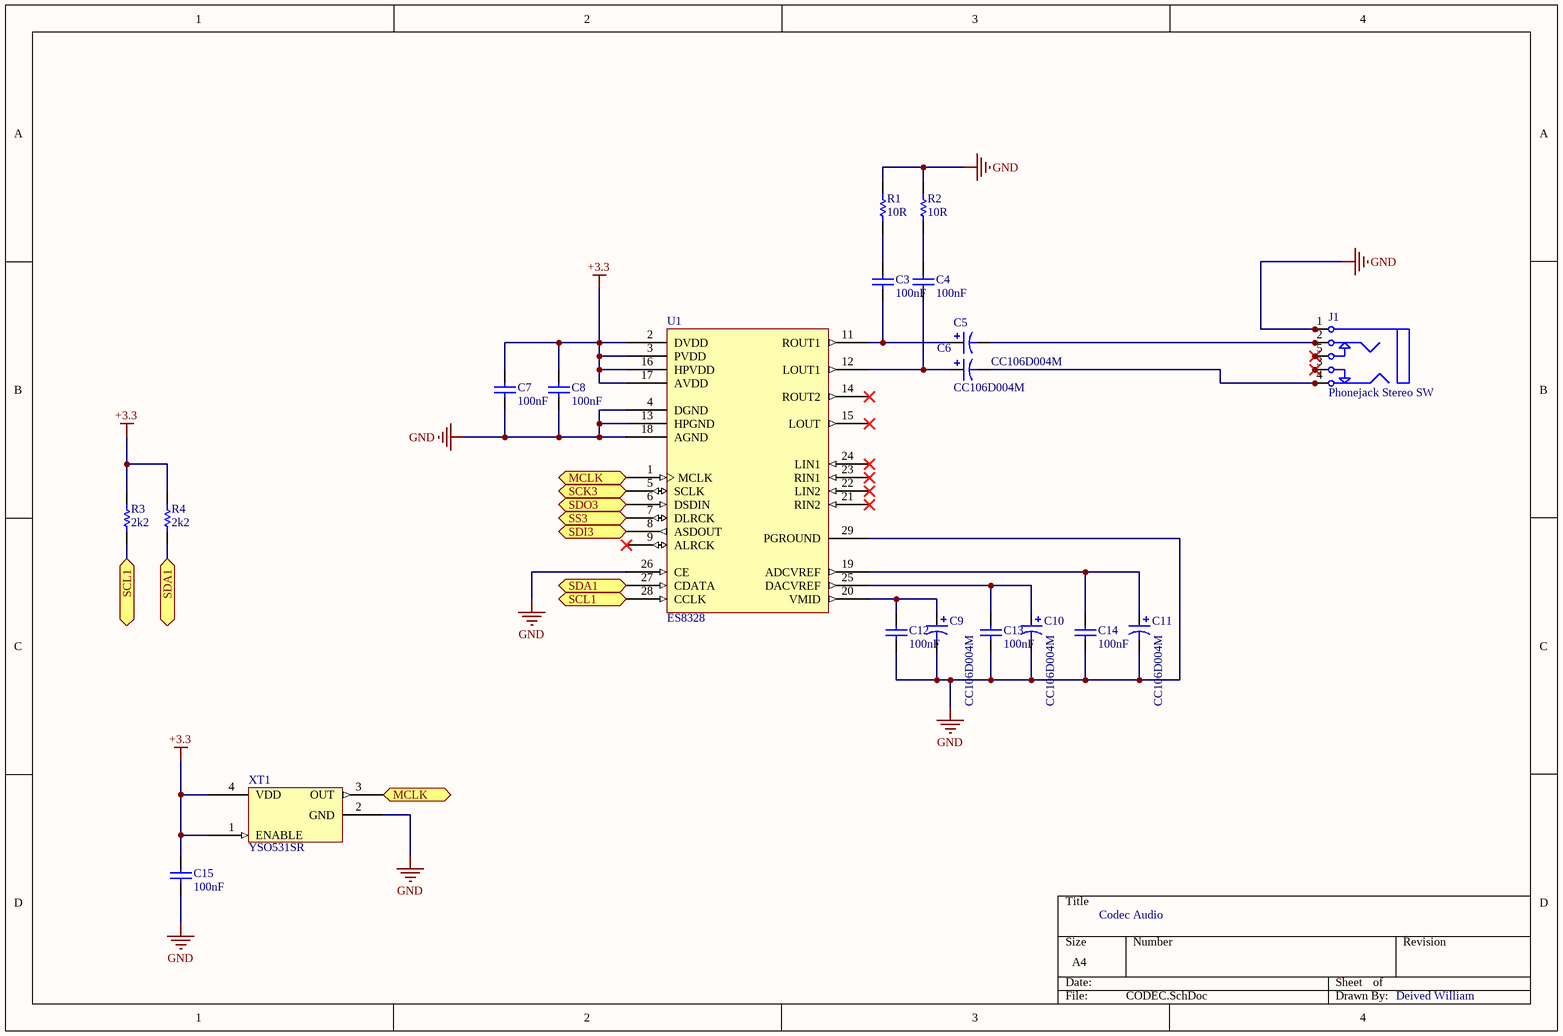
[diagram p5: CODEC.SchDoc]

### Parts
C3  value 100nF  [WCAP-CSGP_0603, 1.6x0.8x0.8mm_Reflow]  (hidden comment: 885012206020)
C4  value 100nF  [WCAP-CSGP_0603, 1.6x0.8x0.8mm_Reflow]  (hidden comment: 885012206020)
C5  CC106D004M  [D]
C6  CC106D004M  [D]
C7  value 100nF  [WCAP-CSGP_0603, 1.6x0.8x0.8mm_Reflow]  (hidden comment: 885012206020)
C8  value 100nF  [WCAP-CSGP_0603, 1.6x0.8x0.8mm_Reflow]  (hidden comment: 885012206020)
C9  CC106D004M  [D]
C10  CC106D004M  [D]
C11  CC106D004M  [D]
C12  value 100nF  [WCAP-CSGP_0603, 1.6x0.8x0.8mm_Reflow]  (hidden comment: 885012206020)
C13  value 100nF  [WCAP-CSGP_0603, 1.6x0.8x0.8mm_Reflow]  (hidden comment: 885012206020)
C14  value 100nF  [WCAP-CSGP_0603, 1.6x0.8x0.8mm_Reflow]  (hidden comment: 885012206020)
C15  value 100nF  [WCAP-CSGP_0603, 1.6x0.8x0.8mm_Reflow]  (hidden comment: 885012206020)
J1  Phonejack Stereo SW  [ST-3150-5N]
R1  10R  [3-0603]
R2  10R  [3-0603]
R3  2k2  [3-0603]
R4  2k2  [3-0603]
U1  ES8328  [QFN-28L]
XT1  YSO531SR  [CRISTAL]

### Ports
MCLK, SCK3, SCL1, SDA1, SDI3, SDO3, SS3

### Nets
+3.3: C7.2 C8.2 C15.1 R3.2 R4.2 U1.2(DVDD) U1.3(PVDD) U1.16(HPVDD) U1.17(AVDD) XT1.1(ENABLE) XT1.4(VDD)
GND: C7.1 C8.1 C9.2 C10.2 C11.2 C12.1 C13.1 C14.1 C15.2 J1.1 J1.1A J1.1B R1.2 R2.2 U1.4(DGND) U1.13(HPGND) U1.18(AGND) U1.26(CE) U1.29(PGROUND) XT1.2(GND)
NetC3_1: C3.1 C5.1 U1.11(ROUT1)
NetC3_2: C3.2 R1.1
NetC4_1: C4.1 C6.1 U1.12(LOUT1)
NetC4_2: C4.2 R2.1
NetC5_2: C5.2 J1.2 J1.2A J1.2B
NetC6_2: C6.2 J1.4 J1.4A J1.4B
NetC9_1: C9.1 C12.2 U1.20(VMID)
NetC10_1: C10.1 C13.2 U1.25(DACVREF)
NetC11_1: C11.1 C14.2 U1.19(ADCVREF)
NetJ1_3: J1.3 J1.3A J1.3B
NetJ1_5: J1.5 J1.5A J1.5B
NetR3_1: R3.1 U1.28(CCLK) ; port SCL1
NetR4_1: R4.1 U1.27(CDATA) ; port SDA1
NetU1_1: U1.1(MCLK) XT1.3(OUT) ; port MCLK
NetU1_5: U1.5(SCLK) ; port SCK3
NetU1_6: U1.6(DSDIN) ; port SDO3
NetU1_7: U1.7(DLRCK) ; port SS3
NetU1_8: U1.8(ASDOUT) ; port SDI3

Not connected (* = marked no-connect by the designer): U1 9(ALRCK)* 14(ROUT2)* 15(LOUT)* 21(RIN2)* 22(LIN2)* 23(RIN1)* 24(LIN1)*

### Notes on the sheet
- Codec Audio
- Deived William

### Library data of the parts
C3 C4 C7 C8 C12-C15 = 885012206020: as C27 on sheet MCU; ComponentLink1Description: Manufacturer; ComponentLink1URL: http://www.we-online.de; ComponentLink2Description: Datasheet; ComponentLink2URL: http://katalog.we-online.de/pbs/datasheet/885012206020.pdf; Part Number: 885012206020; Published Date: June 2017; Publisher: Wurth Elektronik; Size: 0603, 1.6x0.8x0.8mm; Ceramic Type: X7R
C5 C6 C9-C11 = CC106D004M: as C30 on sheet MCU; Published: 19-Mar-2004; DatasheetDocument: 21-Mar-2002; PackageReference: D; Publisher: Altium Limited; ComponentLink1Description: Manufacturer Link; ComponentLink1URL: http://www.vishay.com/; ComponentLink2Description: Datasheet; ComponentLink2URL: http://www.vishay.com/docs/43017/ccec.pdf; Value: 10uF
J1 = Phonejack Stereo SW: 3-Conductor Jack with 2 break contacts (normals) and 2 auxiliary make contacts; Published: 5-Jan-2004; LatestRevisionDate: 17-Dec-2003; LatestRevisionNote: PCB Footprint replaced.; DatasheetDocument: 07-Mar-2000; Publisher: Altium Limited; ComponentLink1Description: Manufacturer Link; ComponentLink1URL: http://domino.kycon.com/internet/Products.html
R1-R4 = ERJ3RE: as R9 on sheet MCU; Published: 17-Dec-2003; LatestRevisionDate: 19-Mar-2004; LatestRevisionNote: Silkscreen size reduced.; PackageDocument: Mar-2003; PackageReference: 3-0603; Publisher: Altium Limited; Code_IPC: 1608 [0603]; ComponentLink1Description: Manufacturer Link; ComponentLink1URL: http://www.panasonic.com/industrial/components/resistive_products.htm; ComponentLink2Description: Datasheet; ComponentLink2URL: http://www.panasonic.com/industrial/components/pdf/AOA0000CE2.pdf
U1 = ES8328: Low Power Estereo Audio Codec With HeadPhone Amplifier
XT1 = YSO531SR: Cristal Oscilator Active 1.8v - 3.3v

## Sheet Decoupling Capacitors.SchDoc
size A4
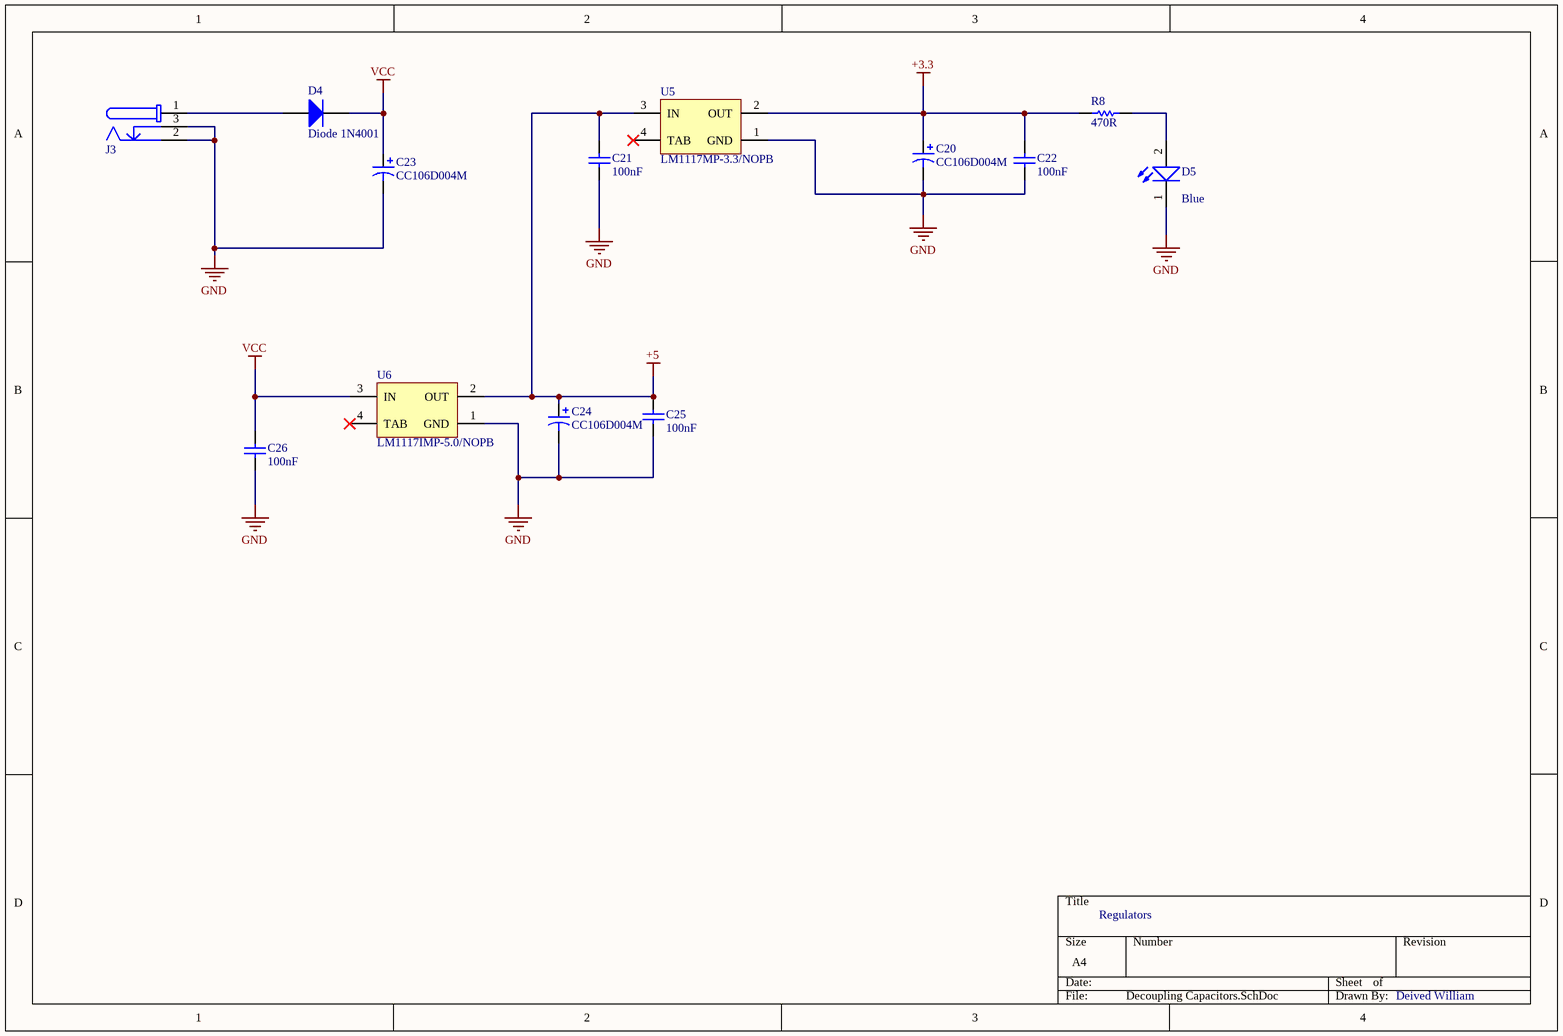
[diagram p6: Decoupling Capacitors.SchDoc]

### Parts
C20  CC106D004M  [D]
C21  value 100nF  [WCAP-CSGP_0603, 1.6x0.8x0.8mm_Reflow]  (hidden comment: 885012206020)
C22  value 100nF  [WCAP-CSGP_0603, 1.6x0.8x0.8mm_Reflow]  (hidden comment: 885012206020)
C23  CC106D004M  [D]
C24  CC106D004M  [D]
C25  value 100nF  [WCAP-CSGP_0603, 1.6x0.8x0.8mm_Reflow]  (hidden comment: 885012206020)
C26  value 100nF  [WCAP-CSGP_0603, 1.6x0.8x0.8mm_Reflow]  (hidden comment: 885012206020)
D4  Diode 1N4001  [DO-41]
D5  Emitting Color: Blue  [WL-SMCW_0805]  (hidden comment: 150080BS75000)
J3  694108301002  [694108301002]  (value not drawn)
R8  470R  [3-0603]
U5  LM1117MP-3.3/NOPB  [MP04A_N]
U6  LM1117IMP-5.0/NOPB  [MP04A_N]

### Nets
+3.3: C20.1 C22.2 R8.1 U5.2(OUT)
+5: C21.2 C24.1 C25.2 U5.3(IN) U6.2(OUT)
GND: C20.2 C21.1 C22.1 C23.2 C24.2 C25.1 C26.1 D5.1(K) J3.2 J3.3 U5.1(GND) U6.1(GND)
VCC: C23.1 C26.2 D4.2(K) U6.3(IN)
NetD4_1: D4.1(A) J3.1
NetD5_2: D5.2(A) R8.2

Not connected (* = marked no-connect by the designer): U5 4(TAB)*; U6 4(TAB)*

### Notes on the sheet
- Regulators
- Deived William

### Library data of the parts
C20 C23 C24 = CC106D004M: as C30 on sheet MCU; Published: 19-Mar-2004; DatasheetDocument: 21-Mar-2002; PackageReference: D; Publisher: Altium Limited; ComponentLink1Description: Manufacturer Link; ComponentLink1URL: http://www.vishay.com/; ComponentLink2Description: Datasheet; ComponentLink2URL: http://www.vishay.com/docs/43017/ccec.pdf; Value: 10uF
C21 C22 C25 C26 = 885012206020: as C27 on sheet MCU; ComponentLink1Description: Manufacturer; ComponentLink1URL: http://www.we-online.de; ComponentLink2Description: Datasheet; ComponentLink2URL: http://katalog.we-online.de/pbs/datasheet/885012206020.pdf; Part Number: 885012206020; Published Date: June 2017; Publisher: Wurth Elektronik; Size: 0603, 1.6x0.8x0.8mm; Ceramic Type: X7R
D4 = Diode 1N4001: 1 Amp General Purpose Rectifier; Published: 8-Jun-2000; LatestRevisionDate: 17-Jul-2002; LatestRevisionNote: Re-released for DXP Platform.; DatasheetVersion: 1998; PackageVersion: Aug-1999; PackageReference: DO-41; Publisher: Altium Limited; PackageDescription: Diode, Axial; Body 5.2 x 2.7 mm (LxDia. max), Lead Dia. 0.86 mm (max); Code_JEDEC: DO-204-AL; ComponentLink1Description: Manufacturer Link; ComponentLink1URL: http://www.fairchildsemi.com/; ComponentLink2Description: Datasheet; ComponentLink2URL: http://www.fairchildsemi.com/ds/1N%2F1N4001.pdf
D5 = 150080BS75000: as D6 on sheet MCU; Published Date: Jan 2017; Publisher: Wurth Elektronik; ComponentLink1Description: Manufacturer; ComponentLink1URL: http://www.we-online.de; ComponentLink2Description: Datasheet; ComponentLink2URL: http://katalog.we-online.de/led/datasheet/150080BS75000.pdf; Part Number: 150080BS75000; Size: 0805
J3 = 694108301002: DC Power Jack Right Angled(6.4) WR-DC; Plug OD: 5.5 mm; Rated Current: 5 A; Working Voltage: 24 VAC; Withstanding Voltage: 500 VAC; Opening Diameter: 6.4 mm; ComponentLink1Description: Manufacturer; ComponentLink1URL: http://www.we-online.de; ComponentLink2Description: Datasheet; ComponentLink2URL: http://katalog.we-online.com/em/datasheet/6941xx301002.pdf; Part Number: 694108301002; Published Date: September 2017; Publisher: Wurth Elektronik
R8 = ERJ3RE: as R9 on sheet MCU; Published: 17-Dec-2003; LatestRevisionDate: 19-Mar-2004; LatestRevisionNote: Silkscreen size reduced.; PackageDocument: Mar-2003; PackageReference: 3-0603; Publisher: Altium Limited; Code_IPC: 1608 [0603]; ComponentLink1Description: Manufacturer Link; ComponentLink1URL: http://www.panasonic.com/industrial/components/resistive_products.htm; ComponentLink2Description: Datasheet; ComponentLink2URL: http://www.panasonic.com/industrial/components/pdf/AOA0000CE2.pdf
U5 = LM1117MP-3.3/NOPB: 800mA Low-Dropout Linear Regulator, 4-pin SOT-223, Pb-Free; Manufacturer: National Semiconductor; PackageTopMarking: XYTT*N05A; PowerWise: N; CompType: LDO IC; Published: 1-Mar-2010; DatasheetVersion: Apr-2006; PackageVersion: revB, Apr-2003; PackageReference: MP04A; Publisher: Altium Limited; PackageDescription: Molded SOT-223, 6.50 x 3.56 x 1.6mm Body, 4 Lead, 2.3mm Pitch; Supplier 1: Digi-Key; Supplier Part Number 1: LM1117MP-3.3TR-ND; Supplier 2: Digi-Key; Supplier Part Number 2: LM1117MP-3.3CT-ND; Supplier 3: Digi-Key; Supplier Part Number 3: LM1117MP-3.3DKR-ND; Supplier 4: Farnell; Supplier Part Number 4: 1469054; PartNumber: LM1117MP-3.3/NOPB; RoHS: Y; PinCount: 4; Code_JEDEC: TO-261-AA; Code_IPC: SOT223-4; ComponentLink1Description: LM1117 Datasheet; ComponentLink1URL: http://www.national.com/ds/LM/LM1117.pdf; ComponentLink2Description: LM1117 Web Page; ComponentLink2URL: http://www.national.com/pf/LM/LM1117.html; ComponentLink3Description: MP04A Package Page; ComponentLink3URL: http://www.national.com/packaging/folders/mp04a.html
U6 = LM1117IMP-5.0/NOPB: 800mA Low-Dropout Linear Regulator, 4-pin SOT-223, Pb-Free; Manufacturer: National Semiconductor; PackageTopMarking: XYTT*N06B; PowerWise: N; CompType: LDO IC; Published: 1-Mar-2010; DatasheetVersion: Apr-2006; PackageVersion: revB, Apr-2003; PackageReference: MP04A; Publisher: Altium Limited; PackageDescription: Molded SOT-223, 6.50 x 3.56 x 1.6mm Body, 4 Lead, 2.3mm Pitch; Supplier 1: Digi-Key; Supplier Part Number 1: LM1117IMP-5.0TR-ND; Supplier 2: Digi-Key; Supplier Part Number 2: LM1117IMP-5.0CT-ND; Supplier 3: Digi-Key; Supplier Part Number 3: LM1117IMP-5.0DKR-ND; Supplier 4: Farnell; Supplier Part Number 4: 1469052; PartNumber: LM1117IMP-5.0/NOPB; RoHS: Y; PinCount: 4; Code_JEDEC: TO-261-AA; Code_IPC: SOT223-4; ComponentLink1Description: LM1117 Datasheet; ComponentLink1URL: http://www.national.com/ds/LM/LM1117.pdf; ComponentLink2Description: LM1117 Web Page; ComponentLink2URL: http://www.national.com/pf/LM/LM1117.html; ComponentLink3Description: MP04A Package Page; ComponentLink3URL: http://www.national.com/packaging/folders/mp04a.html

## Nets that join several sheets
+3.3: MCU (L1.1 R13.2 R14.2), Memory Nor Flash (C41.1 U8.2), Communication (6 pins), LCD (C1.2 P1.1), SD CARD (7 pins), CODEC (11 pins), Decoupling Capacitors (C20.1 C22.2 R8.1 U5.2)
+5: MCU (P2.2), Communication (D1.2), LCD (C2.2 P1.2 P1.4), Decoupling Capacitors (5 pins)
GND: MCU (28 pins), Memory Nor Flash (C41.2 U8.10), Communication (13 pins), LCD (7 pins), SD CARD (7 pins), CODEC (20 pins), Decoupling Capacitors (12 pins)
D_N: MCU (U7.54), Communication (J2.2)
D_P: MCU (U7.55), Communication (J2.3)
NetC18_2: MCU (U7.51), Communication (C18.2 D1.1 J2.1 U3.2)
NetJ2_4: MCU (U7.56), Communication (J2.4)
NetJ4_2: MCU (U7.61), SD CARD (J4.2 R31.2)
NetJ4_3: MCU (U7.64), SD CARD (J4.3 R30.2)
NetJ4_5: MCU (U7.10), SD CARD (J4.5 R29.2)
NetJ4_7: MCU (U7.65), SD CARD (J4.7 R28.2)
NetJ4_11: MCU (U7.44), SD CARD (J4.11 R32.1)
NetP1_11: MCU (U7.16), LCD (P1.11)
NetP1_13: MCU (U7.88), LCD (P1.13)
NetP1_15: MCU (U7.87), LCD (P1.15)
NetP1_19: MCU (U7.85), LCD (P1.19)
NetP1_21: MCU (U7.86), LCD (P1.21)
NetP1_23: MCU (U7.76), LCD (P1.23)
NetP1_24: MCU (U7.18), LCD (P1.24)
NetP1_26: MCU (U7.19), LCD (P1.26)
NetR3_1: MCU (U7.66), CODEC (R3.1 U1.28)
NetR4_1: MCU (U7.67), CODEC (R4.1 U1.27)
NetR16_1: MCU (U7.89), Memory Nor Flash (R16.1)
NetR17_2: MCU (U7.81), Memory Nor Flash (R17.2)
NetR18_1: MCU (U7.97), Memory Nor Flash (R18.1)
NetR19_2: MCU (U7.95), Memory Nor Flash (R19.2)
NetR20_1: MCU (U7.96), Memory Nor Flash (R20.1)
NetR21_2: MCU (U7.90), Memory Nor Flash (R21.2)
NetU1_5: MCU (U7.43), CODEC (U1.5)
NetU1_6: MCU (U7.77), CODEC (U1.6)
NetU1_7: MCU (U7.68), CODEC (U1.7)
NetU1_8: MCU (U7.33), CODEC (U1.8)
NetU2_1: MCU (U7.12), Communication (U2.1)
NetU2_2: MCU (U7.11), Communication (U2.2)
NetU2_3: MCU (U7.39), Communication (U2.3)
NetU2_4: MCU (U7.99), Communication (U2.4)
NetU2_11: MCU (U7.3), Communication (U2.11)
NetU2_34: MCU (U7.40), Communication (U2.34)
NetU3_7: MCU (U7.20), Communication (U3.7)
NetU4_1: MCU (U7.26), Communication (U4.1)
NetU4_3: MCU (U7.27), Communication (U4.3)
NetU4_4: MCU (U7.41), Communication (U4.4)
NetU4_16: MCU (U7.42), Communication (U4.16)
NetU4_17: MCU (U7.22), Communication (U4.17)
NetU4_18: MCU (U7.21), Communication (U4.18)
NetU4_21: MCU (U7.7), Communication (U4.21)
NetU4_22: MCU (U7.32), Communication (U4.22)